# EasyEDA Pro project ProPrj_主控板v1.0_2025-02-24.epro, board PCB6
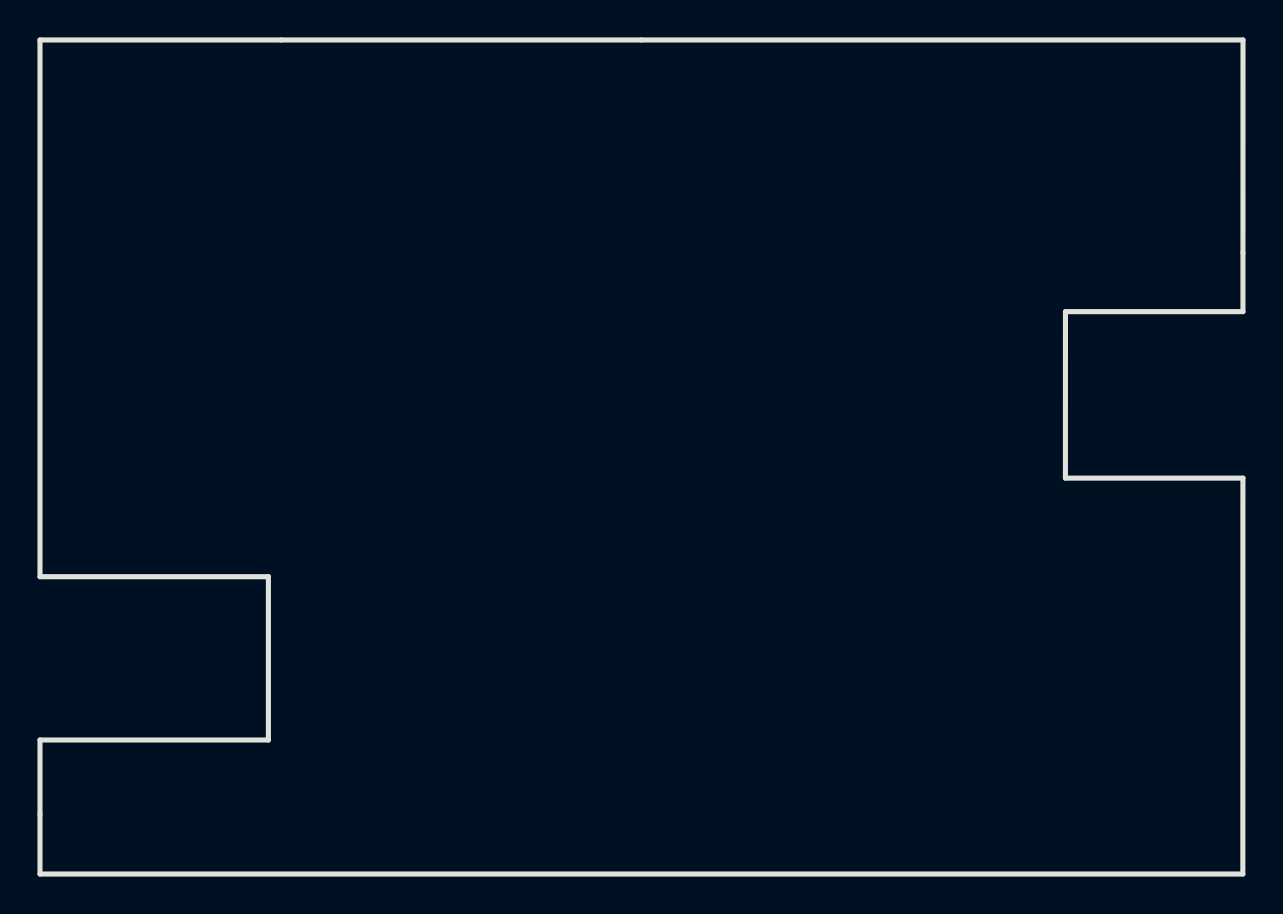
[diagram p14: board, top side]
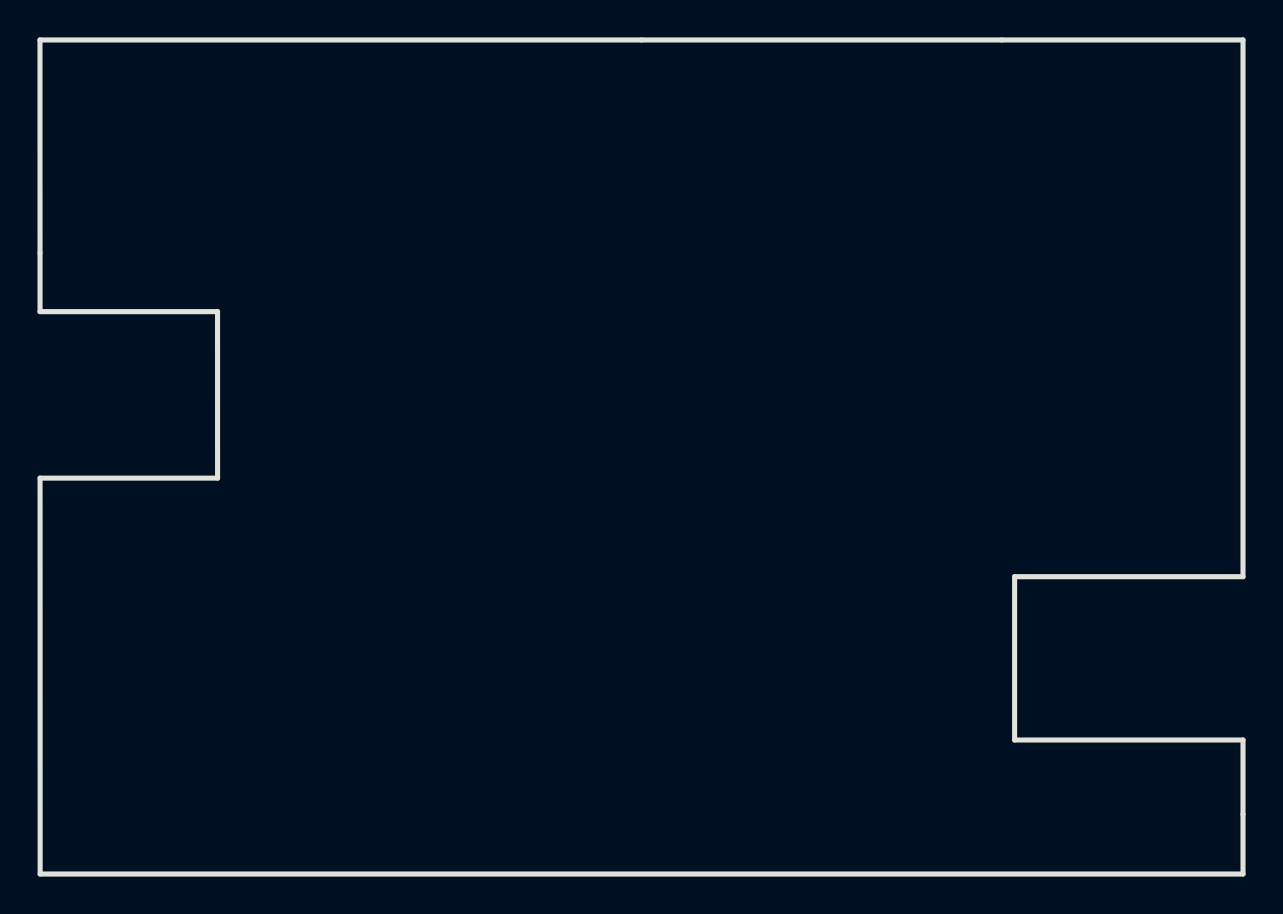
[diagram p15: board, bottom side, seen from below]

Outline 60.16 x 41.74 mm; copper layers: Top Layer, Bottom Layer. Coordinates in mm from the lower left corner of the outline.
Outline path: 0,41.74 60.16,41.74 60.16,31.08 60.16,28.14 51.28,28.14 51.28,19.81 60.16,19.81 60.15,0 0,0 0,6.71 11.42,6.71 11.42,14.88 0,14.88 0,41.74
Stack: Top Layer 0.035mm / Dielectric1 1.51mm FR4 er 4.5 / Bottom Layer 0.035mm

## Design rules (mm)
template: JLCPCB Capability(Two Layers Board)
spacing copperThickness1oz (default): track to track 0.102, other pairs 0.152 to 0.3
spacing copperThickness2oz: track to track 0.203, other pairs 0.152 to 0.3
track width copperThickness1oz (default): min 0.127, default 0.254, max 2.54
track width copperThickness2oz: min 0.203, default 0.254, max 2.54
differential pair differentialPair (default): width min 0.127, default 0.254, max 2.54; gap min 0.152, default 0.152
via viaSize (default): diameter min 0.5, default 0.61, max 10; hole min 0.3, default 0.305, max 6.3

## Placement (name value [footprint] x y rotation side)

## Nets
